# Altium schematic sheet InterfacesB_NONISO232b.SchDoc
size A; DocumentNumber: 5; SheetNumber: 5
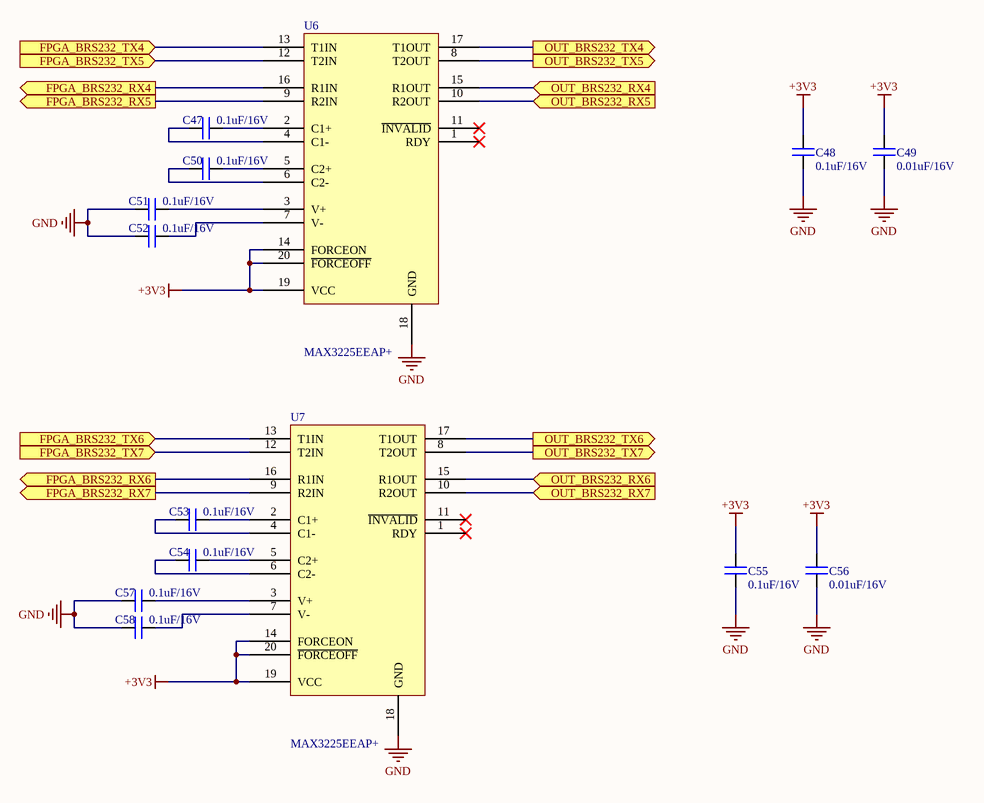
[diagram p0: InterfacesB_NONISO232b.SchDoc]

## Parts
C47  value 0.1uF/16V  [CAP_0805]  (hidden comment: CAP_0805)
C48  value 0.1uF/16V  [CAP_0805]  (hidden comment: CAP_0805)
C49  value 0.01uF/16V  [CAP_0805]  (hidden comment: CAP_0805)
C50  value 0.1uF/16V  [CAP_0805]  (hidden comment: CAP_0805)
C51  value 0.1uF/16V  [CAP_0805]  (hidden comment: CAP_0805)
C52  value 0.1uF/16V  [CAP_0805]  (hidden comment: CAP_0805)
C53  value 0.1uF/16V  [CAP_0805]  (hidden comment: CAP_0805)
C54  value 0.1uF/16V  [CAP_0805]  (hidden comment: CAP_0805)
C55  value 0.1uF/16V  [CAP_0805]  (hidden comment: CAP_0805)
C56  value 0.01uF/16V  [CAP_0805]  (hidden comment: CAP_0805)
C57  value 0.1uF/16V  [CAP_0805]  (hidden comment: CAP_0805)
C58  value 0.1uF/16V  [CAP_0805]  (hidden comment: CAP_0805)
U6  MAX3225EEAP+  [MAX3225EEAP+]
U7  MAX3225EEAP+  [MAX3225EEAP+]

## Ports
FPGA_BRS232_RX4 (out), FPGA_BRS232_RX5 (out), FPGA_BRS232_RX6 (out), FPGA_BRS232_RX7 (out), FPGA_BRS232_TX4 (in), FPGA_BRS232_TX5 (in), FPGA_BRS232_TX6 (in), FPGA_BRS232_TX7 (in), OUT_BRS232_RX4 (in), OUT_BRS232_RX5 (in), OUT_BRS232_RX6 (in), OUT_BRS232_RX7 (in), OUT_BRS232_TX4 (out), OUT_BRS232_TX5 (out), OUT_BRS232_TX6 (out), OUT_BRS232_TX7 (out)

## Nets
+3V3: C48.1 C49.1 C55.1 C56.1 U6.14(FORCEON) U6.19(VCC) U6.20(~{FORCEOFF}) U7.14(FORCEON) U7.19(VCC) U7.20(~{FORCEOFF})
GND: C48.2 C49.2 C51.2 C52.2 C55.2 C56.2 C57.2 C58.2 U6.18(GND) U7.18(GND)
FPGA_BRS232_RX4: U6.16(R1IN) ; port FPGA_BRS232_RX4
FPGA_BRS232_RX5: U6.9(R2IN) ; port FPGA_BRS232_RX5
FPGA_BRS232_RX6: U7.16(R1IN) ; port FPGA_BRS232_RX6
FPGA_BRS232_RX7: U7.9(R2IN) ; port FPGA_BRS232_RX7
FPGA_BRS232_TX4: U6.13(T1IN) ; port FPGA_BRS232_TX4
FPGA_BRS232_TX5: U6.12(T2IN) ; port FPGA_BRS232_TX5
FPGA_BRS232_TX6: U7.13(T1IN) ; port FPGA_BRS232_TX6
FPGA_BRS232_TX7: U7.12(T2IN) ; port FPGA_BRS232_TX7
OUT_BRS232_RX4: U6.15(R1OUT) ; port OUT_BRS232_RX4
OUT_BRS232_RX5: U6.10(R2OUT) ; port OUT_BRS232_RX5
OUT_BRS232_RX6: U7.15(R1OUT) ; port OUT_BRS232_RX6
OUT_BRS232_RX7: U7.10(R2OUT) ; port OUT_BRS232_RX7
OUT_BRS232_TX4: U6.17(T1OUT) ; port OUT_BRS232_TX4
OUT_BRS232_TX5: U6.8(T2OUT) ; port OUT_BRS232_TX5
OUT_BRS232_TX6: U7.17(T1OUT) ; port OUT_BRS232_TX6
OUT_BRS232_TX7: U7.8(T2OUT) ; port OUT_BRS232_TX7
NetC47_1: C47.1 U6.2(C1+)
NetC47_2: C47.2 U6.4(C1-)
NetC50_1: C50.1 U6.5(C2+)
NetC50_2: C50.2 U6.6(C2-)
NetC51_1: C51.1 U6.3(V+)
NetC52_1: C52.1 U6.7(V-)
NetC53_1: C53.1 U7.2(C1+)
NetC53_2: C53.2 U7.4(C1-)
NetC54_1: C54.1 U7.5(C2+)
NetC54_2: C54.2 U7.6(C2-)
NetC57_1: C57.1 U7.3(V+)
NetC58_1: C58.1 U7.7(V-)

Not connected (* = marked no-connect by the designer): U6 1(RDY)* 11(~{INVALID})*; U7 1(RDY)* 11(~{INVALID})*

## Library data of the parts
U6 U7 = MAX3225EEAP+: Supplier 1: Digi-Key; Supplier Part Number 1: MAX3225EEAP+-ND